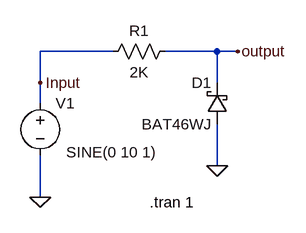
[diagram p0: schematic Half_Wave_rectification.asc]
Half_Wave_rectification.asc, the LTspice schematic file:
Version 4
SHEET 1 1580 876
WIRE 112 144 0 144
WIRE 272 144 192 144
WIRE 304 144 272 144
WIRE 0 192 0 144
WIRE 272 192 272 144
WIRE 0 224 0 192
WIRE 272 320 272 256
WIRE 0 368 0 304
FLAG 0 368 0
FLAG 0 192 Input
FLAG 304 144 output
FLAG 272 320 0
SYMBOL voltage 0 208 R0
WINDOW 123 0 0 Left 2
WINDOW 39 0 0 Left 2
WINDOW 3 40 91 Left 2
SYMATTR Value SINE(0 10 1)
SYMATTR InstName V1
SYMBOL schottky 288 256 R180
WINDOW 0 24 64 Left 2
WINDOW 3 24 0 Left 2
SYMATTR InstName D1
SYMATTR Value BAT46WJ
SYMATTR Description Diode
SYMATTR Type diode
SYMBOL res 208 128 R90
WINDOW 0 0 56 VBottom 2
WINDOW 3 32 56 VTop 2
SYMATTR InstName R1
SYMATTR Value 2K
TEXT 168 376 Left 2 !.tran 1

The netlist it stands for:
* Half_Wave_rectification.asc
V1 Input 0 SINE(0 10 1)
D1 0 output BAT46WJ
R1 output Input 2K
.model D D
.lib standard.dio
.tran 1
.backanno
.end